# Altium schematic sheet Schematic.SchDoc: Speedometer
size 510 x 500 mm; DrawnBy: Amirmohammad Salek; SheetNumber: 1; SheetTotal: 1
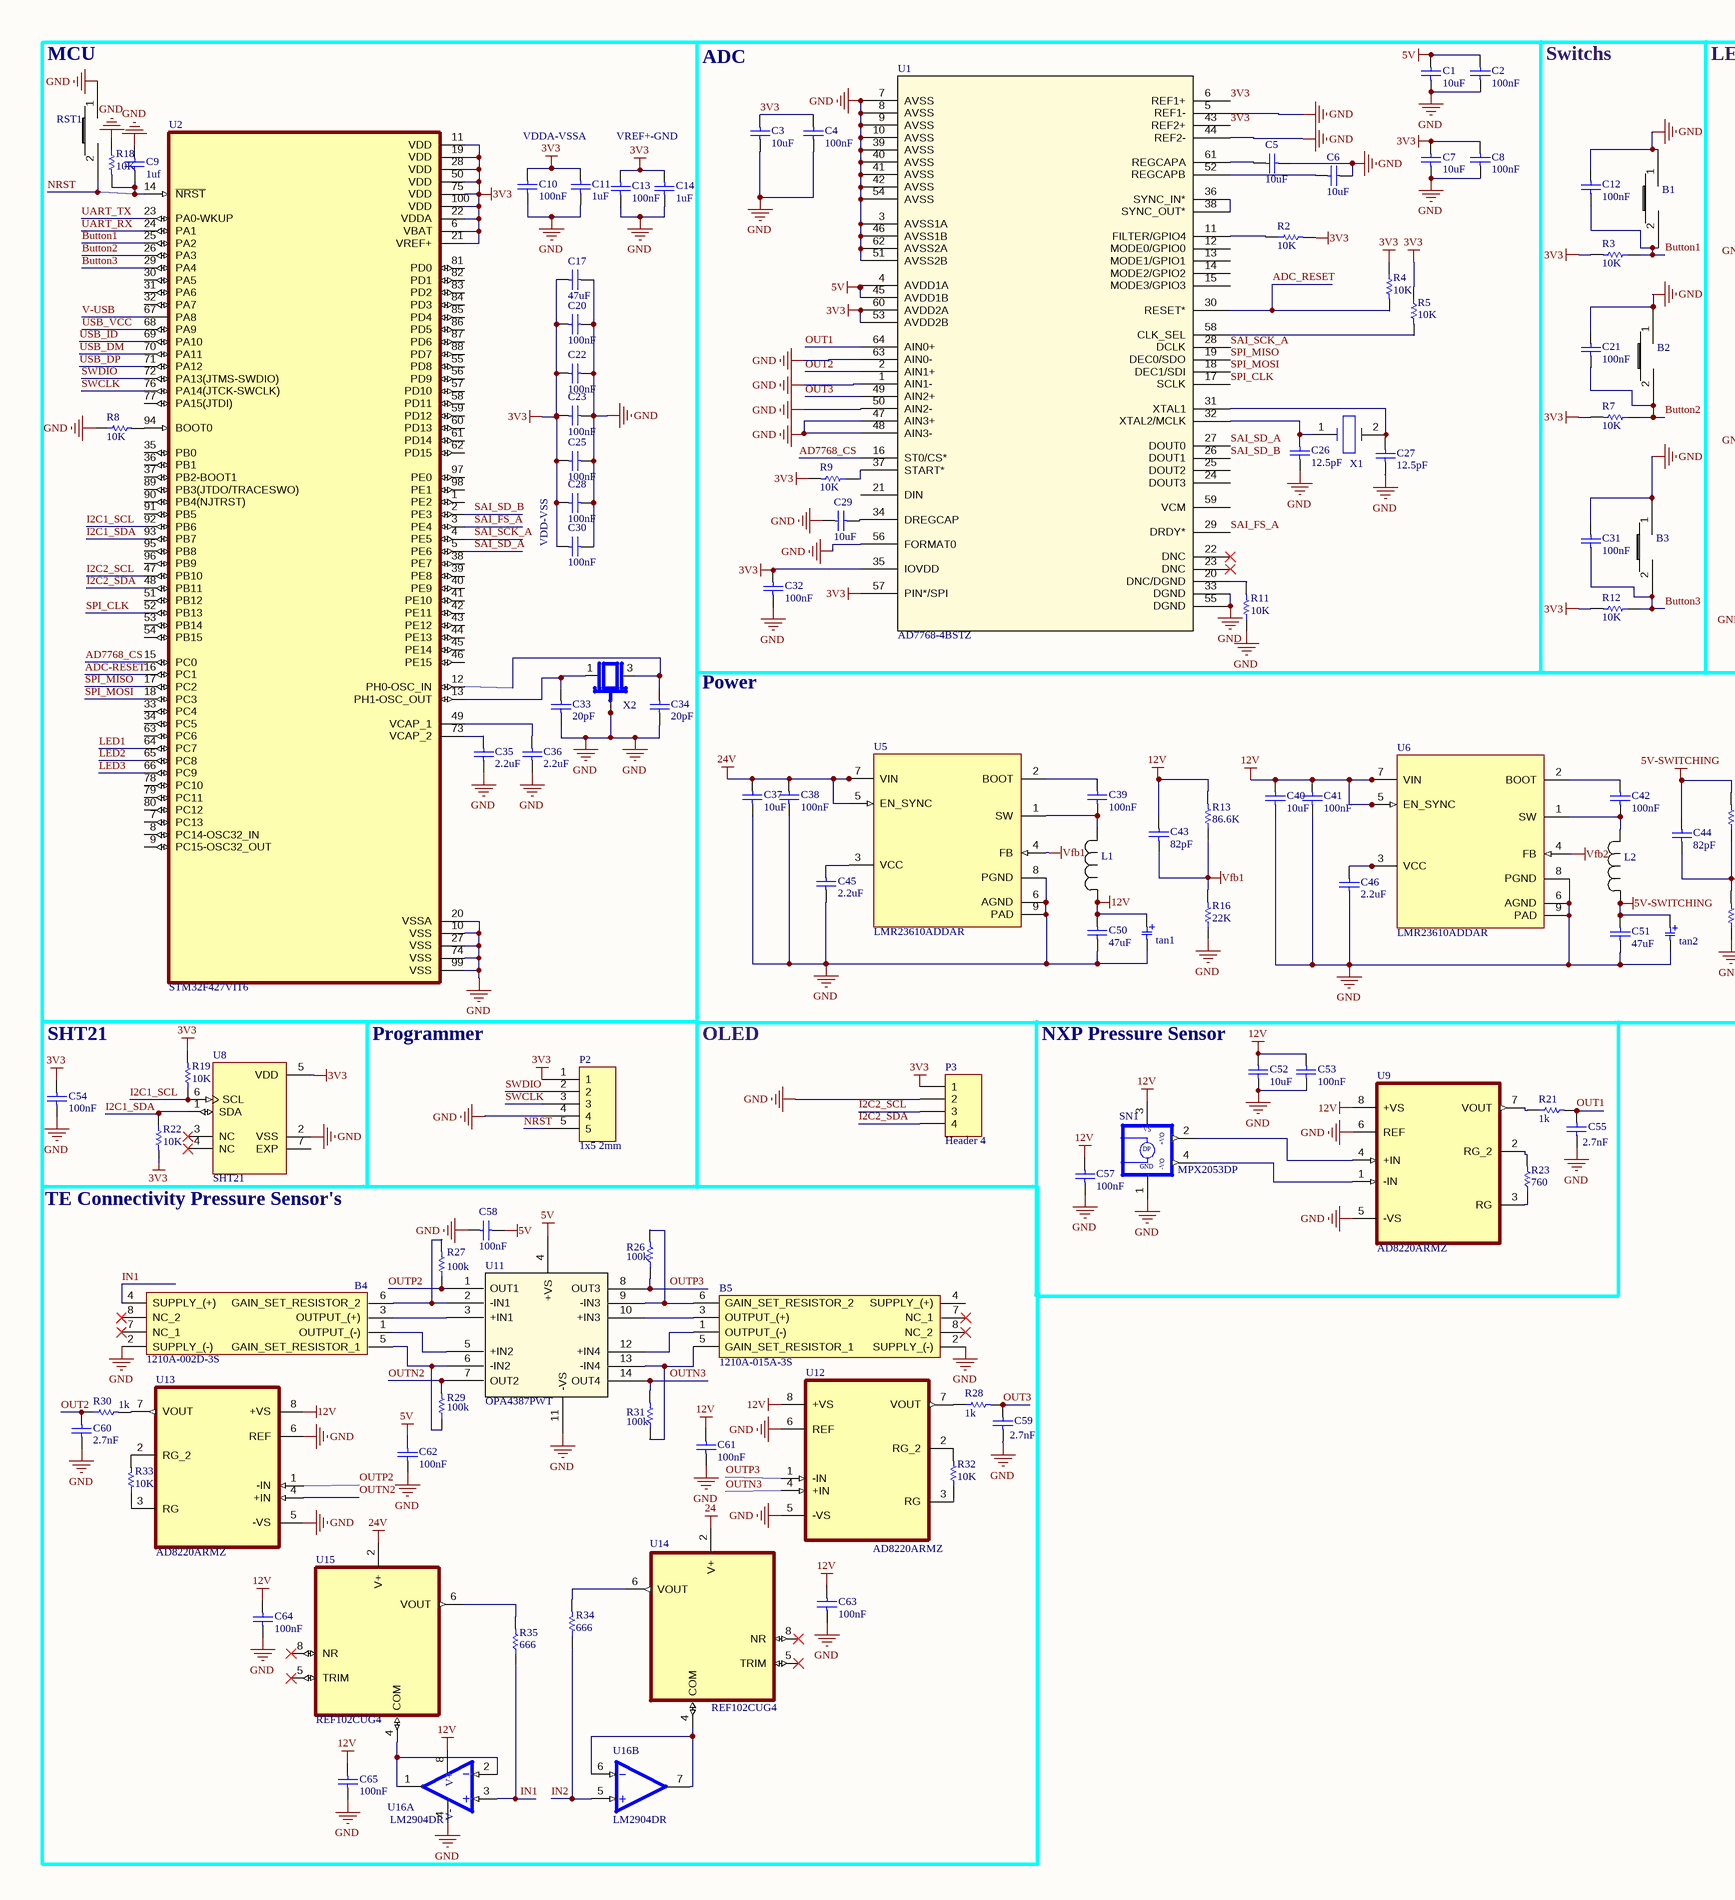
[diagram p0: Schematic.SchDoc, left]
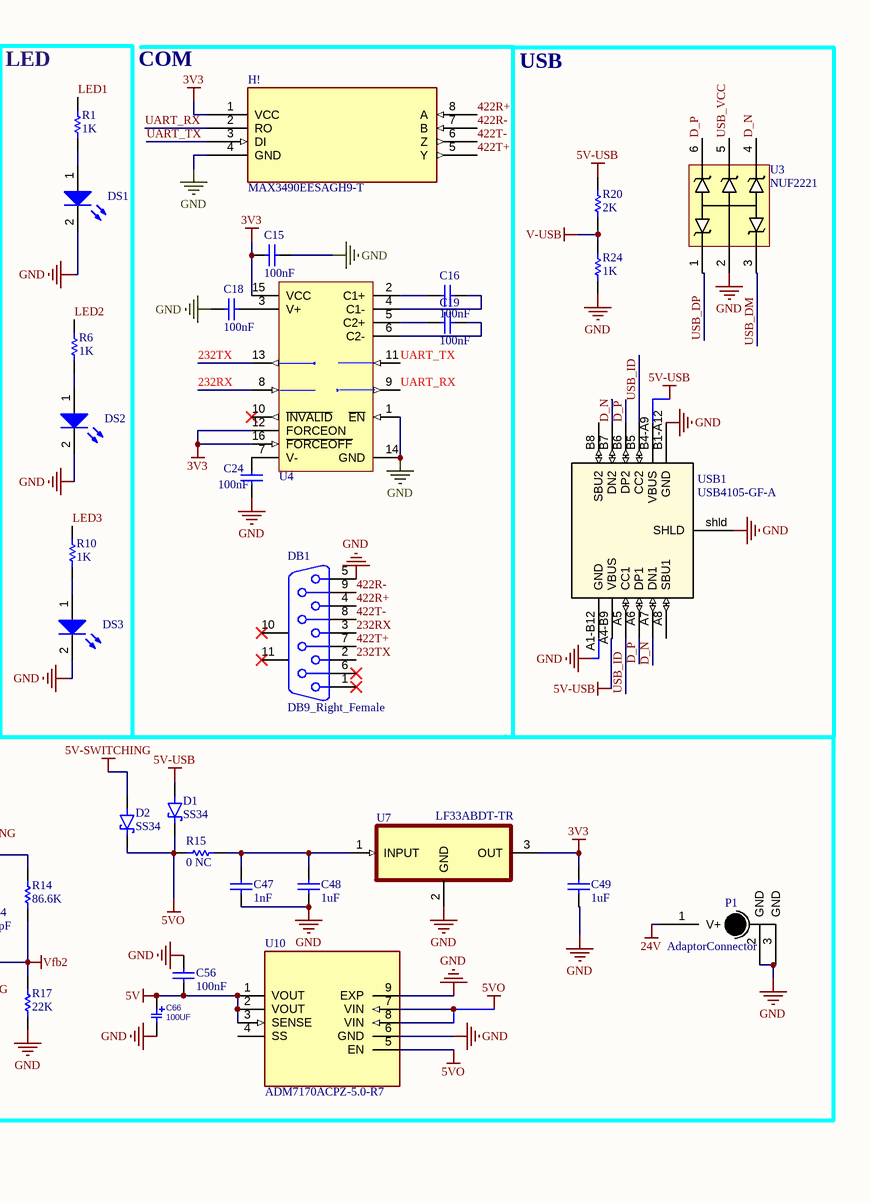
[diagram p1: Schematic.SchDoc, right]

## Parts
B1  Push Button Smd1  [PCBComponent_1]  (value not drawn)
B2  Push Button Smd1  [PCBComponent_1]  (value not drawn)
B3  Push Button Smd1  [PCBComponent_1]  (value not drawn)
B4  1210A-002D-3S  [DIP1524W46P254L1524H1281Q8N]
B5  1210A-015A-3S  [DIP1524W46P254L1524H1281Q8N]
C1  value 10uF  [C0805]  (hidden comment: Cap)
C2  value 100nF  [C0805]  (hidden comment: Cap)
C3  value 10uF  [C0805]  (hidden comment: Cap)
C4  value 100nF  [C0805]  (hidden comment: Cap)
C5  value 10uF  [C0805]  (hidden comment: Cap)
C6  value 10uF  [C0805]  (hidden comment: Cap)
C7  value 10uF  [C0805]  (hidden comment: Cap)
C8  value 100nF  [C0805]  (hidden comment: Cap)
C9  value 1uf  [C0805]  (hidden comment: Cap)
C10  value 100nF  [C0805]  (hidden comment: Cap)
C11  value 1uF  [C0805]  (hidden comment: Cap)
C12  value 100nF  [6-0805_N]  (hidden comment: Cap)
C13  value 100nF  [C0805]  (hidden comment: Cap)
C14  value 1uF  [C0805]  (hidden comment: Cap)
C15  value 100nF  [C0805]  (hidden comment: Cap)
C16  value 100nF  [C0805]  (hidden comment: Cap)
C17  value 47uF  [C0805]  (hidden comment: Cap)
C18  value 100nF  [C0805]  (hidden comment: Cap)
C19  value 100nF  [C0805]  (hidden comment: Cap)
C20  value 100nF  [C0805]  (hidden comment: Cap)
C21  value 100nF  [6-0805_N]  (hidden comment: Cap)
C22  value 100nF  [C0805]  (hidden comment: Cap)
C23  value 100nF  [C0805]  (hidden comment: Cap)
C24  100nF  [C0805]
C25  value 100nF  [C0805]  (hidden comment: Cap)
C26  value 12.5pF  [C0805]  (hidden comment: Cap)
C27  value 12.5pF  [C0805]  (hidden comment: Cap)
C28  value 100nF  [C0805]  (hidden comment: Cap)
C29  value 10uF  [C0805]  (hidden comment: Cap)
C30  value 100nF  [C0805]  (hidden comment: Cap)
C31  value 100nF  [6-0805_N]  (hidden comment: Cap)
C32  value 100nF  [C0805]  (hidden comment: Cap)
C33  value 20pF  [C0805]  (hidden comment: Cap)
C34  value 20pF  [C0805]  (hidden comment: Cap)
C35  value 2.2uF  [C0805]  (hidden comment: Cap)
C36  value 2.2uF  [C0805]  (hidden comment: Cap)
C37  value 10uF  [C1206]  (hidden comment: Cap)
C38  value 100nF  [C1206]  (hidden comment: Cap)
C39  value 100nF  [C0805]  (hidden comment: Cap)
C40  value 10uF  [C1206]  (hidden comment: Cap)
C41  value 100nF  [C1206]  (hidden comment: Cap)
C42  value 100nF  [C0805]  (hidden comment: Cap)
C43  value 82pF  [C0805]  (hidden comment: Cap)
C44  value 82pF  [C0805]  (hidden comment: Cap)
C45  value 2.2uF  [C0805]  (hidden comment: Cap)
C46  value 2.2uF  [C0805]  (hidden comment: Cap)
C47  value 1nF  [C0805]  (hidden comment: Cap)
C48  value 1uF  [C0805]  (hidden comment: Cap)
C49  value 1uF  [C0805]  (hidden comment: Cap)
C50  value 47uF  [C0805]  (hidden comment: Cap)
C51  value 47uF  [C0805]  (hidden comment: Cap)
C52  value 10uF  [C0805]  (hidden comment: Cap)
C53  value 100nF  [C0805]  (hidden comment: Cap)
C54  value 100nF  [C0805]  (hidden comment: Cap)
C55  value 2.7nF  [C0805]  (hidden comment: Cap)
C56  100nF  [C0805]
C57  value 100nF  [C0805]  (hidden comment: Cap)
C58  value 100nF  [C0805]  (hidden comment: Cap)
C59  value 2.7nF  [C0805]  (hidden comment: Cap)
C60  value 2.7nF  [C0805]  (hidden comment: Cap)
C61  value 100nF  [C0805]  (hidden comment: Cap)
C62  value 100nF  [C0805]  (hidden comment: Cap)
C63  value 100nF  [C0805]  (hidden comment: Cap)
C64  value 100nF  [C0805]  (hidden comment: Cap)
C65  value 100nF  [C0805]  (hidden comment: Cap)
C66  100UF  [C_TN_3528]
D1  SS34  [DIOM7959X265N]
D2  SS34  [DIOM7959X265N]
DB1  DB9_Right_Female  [PCBComponent_1]
DS1  (no value)  [LED SMD 0805 - Geeen]
DS2  (no value)  [LED SMD 0805 - Geeen]
DS3  (no value)  [LED SMD 0805 - Geeen]
H!  MAX3490EESAGH9-T  [21-0041B_8]
L1  SLF7045T-150M1R1-PF  [IND_7045_TDK]  (value not drawn)
L2  SLF7045T-150M1R1-PF  [IND_7045_TDK]  (value not drawn)
P1  AdaptorConnector  [AdaptorConnector]
P2  1x5 2mm  [1x5 2mm-No3D]
P3  Header 4  [HDR1X4]
R1  value 1K  [6-0805_N]  (hidden comment: Res1)
R2  10K  [0402RM]
R3  value 10K  [6-0805_N]  (hidden comment: Res1)
R4  10K  [0402RM]
R5  10K  [0402RM]
R6  value 1K  [6-0805_N]  (hidden comment: Res1)
R7  value 10K  [6-0805_N]  (hidden comment: Res1)
R8  value 10K  [6-0805_N]  (hidden comment: Res1)
R9  10K  [0402RM]
R10  value 1K  [6-0805_N]  (hidden comment: Res1)
R11  10K  [0402RM]
R12  value 10K  [6-0805_N]  (hidden comment: Res1)
R13  value 86.6K  [6-0805_N]  (hidden comment: Res1)
R14  value 86.6K  [6-0805_N]  (hidden comment: Res1)
R15  value 0 NC  [6-0805_N]  (hidden comment: Res1)
R16  value 22K  [6-0805_N]  (hidden comment: Res1)
R17  value 22K  [6-0805_N]  (hidden comment: Res1)
R18  10K  [0402RM]
R19  value 10K  [6-0805_N]  (hidden comment: Res1)
R20  value 2K  [6-0805_N]  (hidden comment: Res1)
R21  value 1k  [6-0805_N]  (hidden comment: Res1)
R22  value 10K  [6-0805_N]  (hidden comment: Res1)
R23  value 760  [6-0805_N]  (hidden comment: Res1)
R24  value 1K  [6-0805_N]  (hidden comment: Res1)
R26  value 100k  [6-0805_N]  (hidden comment: Res1)
R27  value 100k  [6-0805_N]  (hidden comment: Res1)
R28  value 1k  [6-0805_N]  (hidden comment: Res1)
R29  value 100k  [6-0805_N]  (hidden comment: Res1)
R30  value 1k  [6-0805_N]  (hidden comment: Res1)
R31  value 100k  [6-0805_N]  (hidden comment: Res1)
R32  value 10K  [6-0805_N]  (hidden comment: Res1)
R33  value 10K  [6-0805_N]  (hidden comment: Res1)
R34  666  [R SMD 0805]
R35  666  [R SMD 0805]
RST1  Push Button Smd1  [PCBComponent_1]  (value not drawn)
SN1  MPX2053DP  [SOP8-1351]
tan1  Component_1  [C_TN_3528]  (value not drawn)
tan2  Component_1  [C_TN_3528]  (value not drawn)
U1  AD7768-4BSTZ  [ST_64_2_ADI]
U2  STM32F427VIT6  [QFP50P1600X1600X160-100N]
U3  NUF2221  [SC70 6L]
U4  MAX3221ECAE  [PCBComponent_1]  (value not drawn)
U5  PackageReference: LMR23610ADDAR  [PCBComponent_1 - duplicate1]  (hidden comment: LMR23630ADDAR)
U6  PackageReference: LMR23610ADDAR  [PCBComponent_1 - duplicate1]  (hidden comment: LMR23630ADDAR)
U7  LF33ABDT-TR  [TO228P972X240-3N]
U8  SHT21  [XDCR_SHT21]
U9  AD8220ARMZ  [SOP65P490X110-8N]
U10  ADM7170ACPZ-5.0-R7  [SON50P300X300X80-9N]
U11  OPA4387PWT  [ADA4807-4ARUZ_ADI]
U12  AD8220ARMZ  [SOP65P490X110-8N]
U13  AD8220ARMZ  [SOP65P490X110-8N]
U14  REF102CUG4  [SOIC127P599X175-8N]
U15  REF102CUG4  [SOIC127P599X175-8N]
U16  LM2904DR  [SOIC127P599X175-8N]  (parts A,B of 2)
USB1  USB4105-GF-A  [USB4105_GCT]
X1  32.768MHz  [Crystal3225]  (value not drawn)
X2  (no value)  [OSC_X322516MLB4SI]

## Blocks framed on the sheet
MCU: C9-C11 C13 C14 C17 C20 C22 C23 C25 C28 C30 C33-C36 R8 R18 RST1 U2 X2
ADC: C1-C8 C26 C27 C29 C32 R2 R4 R5 R9 R11 U1 X1
TE Connectivity Pressure Sensor's: B4 B5 C58-C65 R26-R35 U11-U16

## Nets
3V3: C3.1 C4.2 C7.1 C8.1 C10.1 C11.1 C13.1 C14.1 C15.1 C17.1 C20.1 C22.2 C23.1 C25.1 C28.1 C30.1 C32.2 C49.1 C54.1 H!.1(VCC) P2.1 P3.1 R2.2 R3.2 R4.1 R5.1 R7.2 R9.2 R12.2 R19.2 R22.2 U1.6(REF1+) U1.35(IOVDD) U1.43(REF2+) U1.53(AVDD2B) U1.57(PIN*/SPI) U1.60(AVDD2A) U2.6(VBAT) U2.11(VDD) U2.19(VDD) U2.21(VREF+) U2.22(VDDA) U2.28(VDD) U2.50(VDD) U2.75(VDD) U2.100(VDD) U4.12(FORCEON) U4.15(VCC) U4.16(~{FORCEOFF}) U7.3(OUT) U8.5(VDD)
5V: C1.2 C2.1 C56.2 C58.2 C62.1 C66.1 U1.4(AVDD1A) U1.45(AVDD1B) U10.1(VOUT) U10.2(VOUT) U10.3(SENSE) U11.4(+VS)
5V-SWITCHING: C44.1 C51.1 D2.A L2.2 R14.2 tan2.1
5V-USB: D1.A R20.2 USB1.A4-B9(VBUS) USB1.B4-A9(VBUS)
5VO: D1.C(K) D2.C(K) R15.2 U10.5(EN) U10.7(VIN) U10.8(VIN)
12V: C40.1 C41.1 C43.1 C50.1 C52.1 C53.1 C57.1 C61.1 C63.1 C64.1 C65.1 L1.2 R13.2 SN1.3(VS) tan1.1 U6.5(EN_SYNC) U6.7(VIN) U9.8(+VS) U12.8(+VS) U13.8(+VS) U16.8(V+)
24: U14.2(V+)
24V: C37.1 C38.1 P1.1(V+) U5.5(EN_SYNC) U5.7(VIN) U15.2(V+)
GND: B1.1 B2.1 B3.1 B4.2(SUPPLY_(-)) B5.2(SUPPLY_(-)) C1.1 C2.2 C3.2 C4.1 C5.1 C6.1 C7.2 C8.2 C9.1 C10.2 C11.2 C12.2 C13.2 C14.2 C15.2 C17.2 C18.1 C20.2 C21.2 C22.1 C23.2 C24.1 C25.2 C26.1 C27.1 C28.2 C29.1 C30.2 C31.2 C32.1 C33.2 C34.2 C35.2 C36.2 C37.2 C38.2 C40.2 C41.2 C45.2 C46.2 C47.2 C48.2 C49.2 C50.2 C51.2 C52.2 C53.2 C54.2 C55.2 C56.1 C57.2 C58.1 C59.2 C60.2 C61.2 C62.2 C63.2 C64.2 C65.2 C66.2 DB1.5 DS1.2(K) DS2.2(K) DS3.2(K) H!.4(GND) P1.2(GND) P1.3(GND) P2.4 P3.2 R8.1 R11.1 R16.1 R17.1 R18.1 R24.1 RST1.1 SN1.1(GND) tan1.2 tan2.2 U1.1(AIN1-) U1.3(AVSS1A) U1.5(REF1-) U1.7(AVSS) U1.8(AVSS) U1.9(AVSS) U1.10(AVSS) U1.33(DGND) U1.39(AVSS) U1.40(AVSS) U1.41(AVSS) U1.42(AVSS) U1.44(REF2-) U1.46(AVSS1B) U1.47(AIN3+) U1.48(AIN3-) U1.50(AIN2-) U1.51(AVSS2B) U1.54(AVSS) U1.55(DGND) U1.56(FORMAT0) U1.62(AVSS2A) U1.63(AIN0-) U2.10(VSS) U2.20(VSSA) U2.27(VSS) U2.74(VSS) U2.99(VSS) U3.2 U4.1(~{EN}) U4.14(GND) U5.6(AGND) U5.8(PGND) U5.9(PAD) U6.6(AGND) U6.8(PGND) U6.9(PAD) U7.2(GND) U8.2(VSS) U9.5(-VS) U9.6(REF) U10.6(GND) U10.9(EXP) U11.11(-VS) U12.5(-VS) U12.6(REF) U13.5(-VS) U13.6(REF) U16.4(V-) USB1.A1-B12(GND) USB1.B1-A12(GND) USB1.shld(SHLD) X2.2(GND) X2.4(GND)
V-USB: R20.1 R24.2 U2.67(PA8)
Vfb1: C43.2 R13.1 R16.2 U5.4(FB)
Vfb2: C44.2 R14.1 R17.2 U6.4(FB)
232RX: DB1.3 U4.8(R1IN)
232TX: DB1.2 U4.13(T1OUT)
422R+: DB1.4 H!.8(A)
422R-: DB1.9 H!.7(B)
422T+: DB1.7 H!.5(Y)
422T-: DB1.8 H!.6(Z)
AD7768_CS: U1.16(ST0/CS*) U2.15(PC0)
ADC-RESET: U2.16(PC1)
ADC_RESET: R4.2 U1.30(RESET*)
Button1: B1.2 C12.1 R3.1 U2.25(PA2)
Button2: B2.2 C21.1 R7.1 U2.26(PA3)
Button3: B3.2 C31.1 R12.1 U2.29(PA4)
D_N: U3.4 USB1.A7(DN1) USB1.B7(DN2)
D_P: U3.6 USB1.A6(DP1) USB1.B6(DP2)
I2C1_SCL: R19.1 U2.92(PB6) U8.6(SCL)
I2C1_SDA: R22.1 U2.93(PB7) U8.1(SDA)
I2C2_SCL: P3.3 U2.47(PB10)
I2C2_SDA: P3.4 U2.48(PB11)
IN1: B4.4(SUPPLY_(+)) R35.1 U16.3(IN1+)
IN2: R34.1 U16.5(IN2+)
LED1: R1.2 U2.64(PC7)
LED2: R6.2 U2.65(PC8)
LED3: R10.2 U2.66(PC9)
NRST: C9.2 P2.5 R18.2 RST1.2 U2.14(~{NRST})
OUT1: C55.1 R21.2 U1.64(AIN0+)
OUT2: C60.1 R30.1 U1.2(AIN1+)
OUT3: C59.1 R28.2 U1.49(AIN2+)
OUTN2: R29.2 U11.7(OUT2) U13.4(+IN)
OUTN3: R31.2 U11.14(OUT4) U12.4(+IN)
OUTP2: R27.1 U11.1(OUT1) U13.1(-IN)
OUTP3: R26.1 U11.8(OUT3) U12.1(-IN)
SAI_FS_A: U1.29(DRDY*) U2.3(PE4)
SAI_SCK_A: U1.28(DCLK) U2.4(PE5)
SAI_SD_A: U1.27(DOUT0) U2.5(PE6)
SAI_SD_B: U1.26(DOUT1) U2.2(PE3)
SPI_CLK: U1.17(SCLK) U2.52(PB13)
SPI_MISO: U1.19(DEC0/SDO) U2.17(PC2)
SPI_MOSI: U1.18(DEC1/SDI) U2.18(PC3)
SWCLK: P2.3 U2.76(PA14(JTCK-SWCLK))
SWDIO: P2.2 U2.72(PA13(JTMS-SWDIO))
UART_RX: H!.2(RO) U2.24(PA1) U4.9(R1OUT)
UART_TX: H!.3(DI) U2.23(PA0-WKUP) U4.11(T1IN)
USB_DM: U2.70(PA11) U3.3
USB_DP: U2.71(PA12) U3.1
USB_ID: U2.69(PA10) USB1.A5(CC1) USB1.B5(CC2)
USB_VCC: U2.68(PA9) U3.5
NetB4_1: B4.1(OUTPUT_(-)) U11.5(+IN2)
NetB4_3: B4.3(OUTPUT_(+)) U11.3(+IN1)
NetB4_5: B4.5(GAIN_SET_RESISTOR_1) R29.1 U11.6(-IN2)
NetB4_6: B4.6(GAIN_SET_RESISTOR_2) R27.2 U11.2(-IN1)
NetB5_1: B5.1(OUTPUT_(-)) U11.12(+IN4)
NetB5_3: B5.3(OUTPUT_(+)) U11.10(+IN3)
NetB5_5: B5.5(GAIN_SET_RESISTOR_1) R31.1 U11.13(-IN4)
NetB5_6: B5.6(GAIN_SET_RESISTOR_2) R26.2 U11.9(-IN3)
NetC5_2: C5.2 U1.61(REGCAPA)
NetC6_2: C6.2 U1.52(REGCAPB)
NetC16_1: C16.1 U4.2(C1+)
NetC16_2: C16.2 U4.4(C1-)
NetC18_2: C18.2 U4.3(V+)
NetC19_1: C19.1 U4.5(C2+)
NetC19_2: C19.2 U4.6(C2-)
NetC24_2: C24.2 U4.7(V-)
NetC26_2: C26.2 U1.32(XTAL2/MCLK) X1.1
NetC27_2: C27.2 U1.31(XTAL1) X1.2
NetC29_2: C29.2 U1.34(DREGCAP)
NetC33_1: C33.1 U2.13(PH1-OSC_OUT) X2.1
NetC34_1: C34.1 U2.12(PH0-OSC_IN) X2.3
NetC35_1: C35.1 U2.73(VCAP_2)
NetC36_1: C36.1 U2.49(VCAP_1)
NetC39_1: C39.1 U5.2(BOOT)
NetC39_2: C39.2 L1.1 U5.1(SW)
NetC42_1: C42.1 U6.2(BOOT)
NetC42_2: C42.2 L2.1 U6.1(SW)
NetC45_1: C45.1 U5.3(VCC)
NetC46_1: C46.1 U6.3(VCC)
NetC47_1: C47.1 C48.1 R15.1 U7.1(INPUT)
NetDS1_1: DS1.1(A) R1.1
NetDS2_1: DS2.1(A) R6.1
NetDS3_1: DS3.1(A) R10.1
NetR2_1: R2.1 U1.11(FILTER/GPIO4)
NetR5_2: R5.2 U1.58(CLK_SEL)
NetR8_2: R8.2 U2.94(BOOT0)
NetR9_1: R9.1 U1.37(START*)
NetR11_2: R11.2 U1.20(DNC/DGND)
NetR21_1: R21.1 U9.7(VOUT)
NetR23_1: R23.1 U9.3(RG)
NetR23_2: R23.2 U9.2(RG_2)
NetR28_1: R28.1 U12.7(VOUT)
NetR30_2: R30.2 U13.7(VOUT)
NetR32_1: R32.1 U12.3(RG)
NetR32_2: R32.2 U12.2(RG_2)
NetR33_1: R33.1 U13.3(RG)
NetR33_2: R33.2 U13.2(RG_2)
NetR34_2: R34.2 U14.6(VOUT)
NetR35_2: R35.2 U15.6(VOUT)
NetSN1_2: SN1.2(+VOUT) U9.4(+IN)
NetSN1_4: SN1.4(-VOUT) U9.1(-IN)
NetU1_36: U1.36(SYNC_IN*) U1.38(SYNC_OUT*)
NetU14_4: U14.4(COM) U16.6(IN2-) U16.7(OUT2)
NetU15_4: U15.4(COM) U16.1(OUT1) U16.2(IN1-)

Not connected (* = marked no-connect by the designer): B4 7(NC_1)* 8(NC_2)*; B5 4(SUPPLY_(+)) 7(NC_1)* 8(NC_2)*; DB1 1* 6* 10(MH1)* 11(MH2)*; U1 12(MODE0/GPIO0) 13(MODE1/GPIO1) 14(MODE2/GPIO2) 15(MODE3/GPIO3) 21(DIN) 22(DNC)* 23(DNC)* 24(DOUT3) 25(DOUT2) 59(VCM); U2 1(PE2) 7(PC13) 8(PC14-OSC32_IN) 9(PC15-OSC32_OUT) 30(PA5) 31(PA6) 32(PA7) 33(PC4) 34(PC5) 35(PB0) 36(PB1) 37(PB2-BOOT1) 38(PE7) 39(PE8) 40(PE9) 41(PE10) 42(PE11) 43(PE12) 44(PE13) 45(PE14) 46(PE15) 51(PB12) 53(PB14) 54(PB15) 55(PD8) 56(PD9) 57(PD10) 58(PD11) 59(PD12) 60(PD13) 61(PD14) 62(PD15) 63(PC6) 77(PA15(JTDI)) 78(PC10) 79(PC11) 80(PC12) 81(PD0) 82(PD1) 83(PD2) 84(PD3) 85(PD4) 86(PD5) 87(PD6) 88(PD7) 89(PB3(JTDO/TRACESWO)) 90(PB4(NJTRST)) 91(PB5) 95(PB8) 96(PB9) 97(PE0) 98(PE1); U4 10(~{INVALID})*; U8 3(NC)* 4(NC)* 7(EXP); U10 4(SS); U14 5(TRIM)* 8(NR)*; U15 5(TRIM)* 8(NR)*; USB1 A8(SBU1) B8(SBU2)

## Notes on the sheet
- Switchs
- LED
- COM
- USB
- VDDA-VSSA
- VREF+-GND
- VDD-VSS
- (near C34) Power
- (near C54) SHT21
- Programmer
- OLED
- (near C52) NXP Pressure Sensor
- DWG NO:
- REV:
- THIS DOCUMENT AND THE DATA DISCLOSED HEREIN OR
- HEREWITH IS THE PROPERTY OF ALTIUM LIMITED AND MAY
- BE FREELY DISTRIBUTED IN WHOLE. NO RIGHTS ARE
- RESERVED OR EXPRESS OR IMPLIED WARANTEE GIVEN.
- REVISION
- DESCRIPTION
- DATE
- APPROVED
- ENG:
- APPROVALS
- PROJECT
- DSN:
- CHK:
- REFERENCE DOCUMENTS
- PROJECT REVISION:
- TITLE
- DOCUMENT REVISION:
- DESIGN ITEM:
- BOM:
- FAB DWG:
- PCB DWG:
- ASSY DWG:
- SCALE:
- A2
- SIZE
- CAGE CODE
- FILE NAME
- DWG NO.
- SHEET
- OF
- REV
- (in symbol MPXV4006DP) +VO; DP; -VO

## Library data of the parts
B4 B5 = 1210A-015A-3S: Board Mount Pressure Sensors 0-15psia 0-100mV Short Port; Manufacturer_Name: TE Connectivity; Geometry.Height: 12.81mm; Mouser Part Number: 824-1210A-015A-3S; Mouser Price/Stock: https://www.mouser.com/Search/Refine.aspx?Keyword=824-1210A-015A-3S; Manufacturer_Part_Number: 1210A-015A-3S; Datasheet Link: https://componentsearchengine.com/Datasheets/1/1210A-015A-3S.pdf
C1-C11 C13-C20 C22 C23 C25-C30 C32-C55 C57-C65 = Cap_2: Capacitor; Published: 8-Jun-2000; LatestRevisionDate: 17-Jul-2002; LatestRevisionNote: Re-released for DXP Platform.; PackageReference: RAD-0.3; Publisher: Altium Limited; PackageDescription: Radial Cap, Thru-Hole; 2 Leads; 0.3 in Pin Spacing
C12 C21 C31 = Cap: Capacitor; Published: 8-Jun-2000; LatestRevisionDate: 17-Jul-2002; LatestRevisionNote: Re-released for DXP Platform.; PackageReference: RAD-0.3; Publisher: Altium Limited; PackageDescription: Radial Cap, Thru-Hole; 2 Leads; 0.3 in Pin Spacing
C24 = C SMD: Ceramic Chip Capacitor - Standard; Note: Footprint corresponds to dimensions for bulk cassette packaging. This case size has tightened tolerances.; Published: 17-Jul-2002; LatestRevisionDate: 19-Mar-2004; LatestRevisionNote: Silkscreen size reduced.; DatasheetDocument: Mar-2001; PackageDocument: Mar-2001; PackageReference: 0603; Publisher: Altium Limited; Code_JEITA: 0603; Code_IPC: 1608 [0603]; ComponentLink1Description: Manufacturer Link; ComponentLink1URL: http://www.kemet.com/; ComponentLink2Description: Datasheet; ComponentLink2URL: http://www.kemet.com/kemet/web/homepage/kechome.nsf/vapubfilesname/F3102TA.pdf/$file/F3102TA.pdf; Value: 100nF
C56 = C0603: PackageReference: 0603 [1608]; ComponentLink1Description: Manufacturer Link; ComponentLink1URL: http://www.kemet.com/; ComponentLink2Description: Datasheet; ComponentLink2URL: http://www.kemet.com/kemet/web/homepage/kechome.nsf/vapubfilesname/F3102TA.pdf/$file/F3102TA.pdf; Value: 100nF
C66 = CAP_SMD_TAN: CAP, SMD, TAN,; PARAM: 25V; VALUE: 100UF
D1 D2 = SS34: Diode Schottky 40 V 3A Surface Mount SMC (DO-214AB); MF: onsemi; SnapEDA_Link: https://www.snapeda.com/parts/SS34/Onsemi/view-part/?ref=snap; Package: SMC-2 ON Semiconductor; Value: *; MP: SS34; Check_prices: https://www.snapeda.com/parts/SS34/Onsemi/view-part/?ref=eda
DB1 = D Connector 9: Receptacle Assembly, 9 Position, Right Angle; PackageDocument: O; Positions: 9; Published: 15-Jun-2001; LatestRevisionDate: 17-Jul-2002; LatestRevisionNote: Re-released for DXP Platform.; DatasheetDocument: 1-Sep-1999; PackageReference: 788750; Publisher: Altium Limited; Orientation: Right Angle; Gender: Receptacle
DS1-DS3 = LED SMD
H! = MAX3490EESAGH9-T: RS-422/RS-485 Interface IC 3.3V Powered, 15kV ESD-Protected, 12Mbps, Slew-Rate-Limited True RS-485/RS-422 Transceivers; MF: Analog Devices; MP: MAX3490EESA/GH9-T; SnapEDA_Link: https://www.snapeda.com/parts/MAX3490EESA/GH9-T/Analog+Devices/view-part/?ref=snap; Package: None; Value: *; Check_prices: https://www.snapeda.com/parts/MAX3490EESA/GH9-T/Analog+Devices/view-part/?ref=eda
L1 L2 = SLF7045T-680MR60-PF: No Description Available; Mfr_Name: TDK; Copyright: Copyright (C) 2022 Ultra Librarian. All rights reserved.; Manufacturer_Part_Number: SLF7045T-150M1R1-PF
P3 = Header 4: Header, 4-Pin; LatestRevisionDate: 17-Jul-2002; LatestRevisionNote: Re-released for DXP Platform.; Publisher: Altium Limited
R1 R3 R6 R7 R10 R12-R17 R20 R24 = Res1: Resistor; Published: 8-Jun-2000; LatestRevisionDate: 17-Jul-2002; LatestRevisionNote: Re-released for DXP Platform.; PackageReference: AXIAL-0.3; Publisher: Altium Limited; PackageDescription: Axial Device, Thru-Hole; 2 Leads; 0.3 in Pin Spacing
R2 R4 R5 R9 R11 R18 R34 R35 = R SMD: Metal Film Thermosensitive Chip Resistor, 0.56 Ohm to 10k Ohm Range, 5% Tolerance, 0805 Size, 0.1 W; Note: If flow soldering, adjust pad width of PCB Footprint to 0.7 - 0.8 times the width of the resistor.; Published: 17-Dec-2003; LatestRevisionDate: 19-Mar-2004; LatestRevisionNote: Silkscreen size reduced.; PackageReference: ERA-0805; Publisher: Altium Limited; PackageDocument: Mar-2003; Code_IPC: 2012 [0805]; ComponentLink1Description: Manufacturer Link; ComponentLink1URL: http://www.panasonic.com/industrial/components/resistive_products.htm; ComponentLink2Description: Datasheet; ComponentLink2URL: http://www.panasonic.com/industrial/components/pdf/AOF0000CE1.pdf
  R2 R4 R5 R9 R11 R18: value: 10K
  R34 R35: value: 666
R8 R19 R21-R23 R26-R33 = Res1_3: Resistor; Published: 8-Jun-2000; LatestRevisionDate: 17-Jul-2002; LatestRevisionNote: Re-released for DXP Platform.; PackageReference: AXIAL-0.3; Publisher: Altium Limited; PackageDescription: Axial Device, Thru-Hole; 2 Leads; 0.3 in Pin Spacing
SN1 = MPXV4006DP: Pressure Sensor 0.87PSI _6kPa_ Differential Male - 0.13 _3.3mm_ Tube, Dual 0.2 V ~ 4.7 V 8-BSOP _0.475, 12.06mm Width_ Dual Ports, Same Side; MF: NXP USA; MP: MPXV4006DP; Availability: Unavailable; Price: None; SnapEDA_Link: https://www.snapeda.com/parts/MPXV4006DP/NXP%20USA%20Inc./view-part/797022/?ref=snap; Package: - NXP USA; Value: *
U1 = AD7768-4BSTZ: No Description Available; Mfr_Name: Analog Devices Inc; Copyright: Copyright (C) 2023 Ultra Librarian. All rights reserved.; Manufacturer_Part_Number: AD7768-4BSTZ; RefDes: RefDes; Type: DEV
U2 = STM32F427VIT6: ARMÂ® CortexÂ®-M4 STM32F4 Microcontroller IC 32-Bit 180MHz 2MB (2M x 8) FLASH 100-LQFP (14x14); MF: STMicroelectronics; SnapEDA_Link: https://www.snapeda.com/parts/STM32F427VIT6/STMicroelectronics/view-part/225734/?ref=snap; Price: None; MP: STM32F427VIT6; Value: *; Availability: Unavailable; Package: LQFP-100 STMicroelectronics
U3 = SMF05C: TVS Diode Array  For ESD and Latch-Up Protection; Note: Pins 1, 3, 7 and 8 are not connected; Pin 4 is connected to case; Published: 8-Jun-2000; LatestRevisionDate: 13-Apr-2006; LatestRevisionNote: IPC-7351 Footprint Added.; DatasheetVersion: REV. B 1992; PackageVersion: revA; PackageReference: SO-8; Publisher: Altium Limited; PackageDescription: 8-Pin Small Outline Integrated Circuit 1.27 mm Pitch; Code_JEDEC: MS-012-AA; Code_IPC: SOIC127P600-8; ComponentLink1Description: Manufacturer Link; ComponentLink1URL: http://www.analog.com/en/prod/0%2C2877%2CREF01%2C00.html; ComponentLink2Description: Datasheet; ComponentLink2URL: http://www.analog.com/UploadedFiles/Data_Sheets/400769540REF01_g.pdf
U4 = MAX3221ECAE: ±15kV ESD-Protected, 1µA, 3.0V/5.5V, 250kbps, RS-232 Transceiver with AutoShutdown; Published: 16-Jan-2001; LatestRevisionDate: 29-May-2009; LatestRevisionNote: IPC-7351 Footprint Added.; DatasheetVersion: Jan-1998; PackageVersion: 1996; PackageReference: SSOP16; Publisher: Altium Limited; PackageDescription: 16-Pin Small Outline Package 0.65 mm Pitch; Code_JEDEC: MO-150-AC; Code_IPC: SOP65P780-16; ComponentLink1Description: Manufacturer Link; ComponentLink1URL: http://www.maxim-ic.com/; ComponentLink2Description: Datasheet; ComponentLink2URL: http://pdfserv.maxim-ic.com/en/ds/MAX3221E-MAX3243E.pdf
U5 U6 = LMR23630ADDAR: Manufacturer Name: Texas Instruments; Manufacturer Part Number: LMR23630ADDAR; Value: N/A
U7 = LF33ABDT-TR: Linear Voltage Regulator IC 1 Output 500mA DPAK; MF: STMicroelectronics; SnapEDA_Link: https://www.snapeda.com/parts/LF33ABDT-TR/STMicroelectronics/view-part/281804/?ref=snap; Availability: Unavailable; Price: None; Package: TO-252 STMicroelectronics; Value: *; MP: LF33ABDT-TR
U8 = SHT21: SENSOR HUMID/TEMP 3V I2C 2% SMD; MF: Sensirion AG; SnapEDA_Link: https://www.snapeda.com/parts/SHT21/Sensirion+AG/view-part/?ref=snap; Package: DFN-6 Sensirion; Value: *; MP: SHT21; Check_prices: https://www.snapeda.com/parts/SHT21/Sensirion+AG/view-part/?ref=eda
U9 U12 U13 = AD8220ARMZ: Ð£ÑÐ¸Ð»Ð¸Ñ‚ÐµÐ»ÑŒ Ð¸Ð½ÑÑ‚Ñ€ÑƒÐ¼ÐµÐ½Ñ‚Ð¾Ð²ÐºÐ¸ 1 Ð¦ÐµÐ¿ÑŒ Rail-to-Rail 8-MSOP; MF: Analog Devices; SnapEDA_Link: https://www.snapeda.com/parts/AD8220ARMZ/Analog%20Devices%20Inc./view-part/210707/?ref=snap; Availability: Unavailable; MP: AD8220ARMZ; Package: MSOP-8 Analog Devices; Price: None; Value: *
U10 = ADM7170ACPZ-5.0-R7: Linear Voltage Regulator IC Positive Adjustable 1 Output 500mA 8-LFCSP-WD (3x3); MF: {'manufacturer': u'Analog Devices Inc.'}; Package: None; Price: None; Value: *; MP: ADM7170ACPZ-5.0-R7; Availability: Unavailable
U11 = ADA4807-4ARUZ: No Description Available; Mfr_Name: Analog Devices Inc; Copyright: Copyright (C) 2023 Ultra Librarian. All rights reserved.; Manufacturer_Part_Number: ADA4807-4ARUZ; RefDes: RefDes; Type: DEV
U14 U15 = REF102CUG4: 2.5-ppm/C drift, 10-V precision voltage reference 8-SOIC -25 to 85; MF: Texas Instruments; Purchase-URL: https://pricing.snapeda.com/search/part/REF102CUG4/?ref=eda; Check_prices: https://www.snapeda.com/parts/REF102CUG4/Texas+Instruments/view-part/?ref=eda; Value: *; Package: SOIC-8 Texas Instruments; Price: None; Availability: In Stock; MP: REF102CUG4; SnapEDA_Link: https://www.snapeda.com/parts/REF102CUG4/Texas+Instruments/view-part/?ref=snap
U16 = LM2904DR: General Purpose Amplifier 2 Circuit 8-SOIC; MF: Texas Instruments; Package: SOIC-8 Texas Instruments; Availability: Unavailable; MP: LM2904DR; Value: *; SnapEDA_Link: https://www.snapeda.com/parts/LM2904DR/Texas%20Instruments/view-part/105730/?ref=snap; Price: None
USB1 = USB4105-GF-A: No Description Available; Mfr_Name: Global Connector Technology; Copyright: Copyright (C) 2023 Ultra Librarian. All rights reserved.; Manufacturer_Part_Number: USB4105-GF-A; RefDes: RefDes; Type: DEV
X1 = Crystal
X2 = X322516MLB4SI: External dimensions: 3.2 x 2.5 x 0.8 mm.Frequency range: 11.0592MHz ~54MHz; MF: YXC; Availability: Unavailable; MP: X322516MLB4SI; Package: Package; SnapEDA_Link: https://www.snapeda.com/parts/X322516MLB4SI/YXC/view-part/4703090/?ref=snap; Check_prices: https://www.snapeda.com/parts/X322516MLB4SI/YXC/view-part/4703090/?ref=eda; Value: *; Price: None